# Altium project Relay_SW.PrjPcb
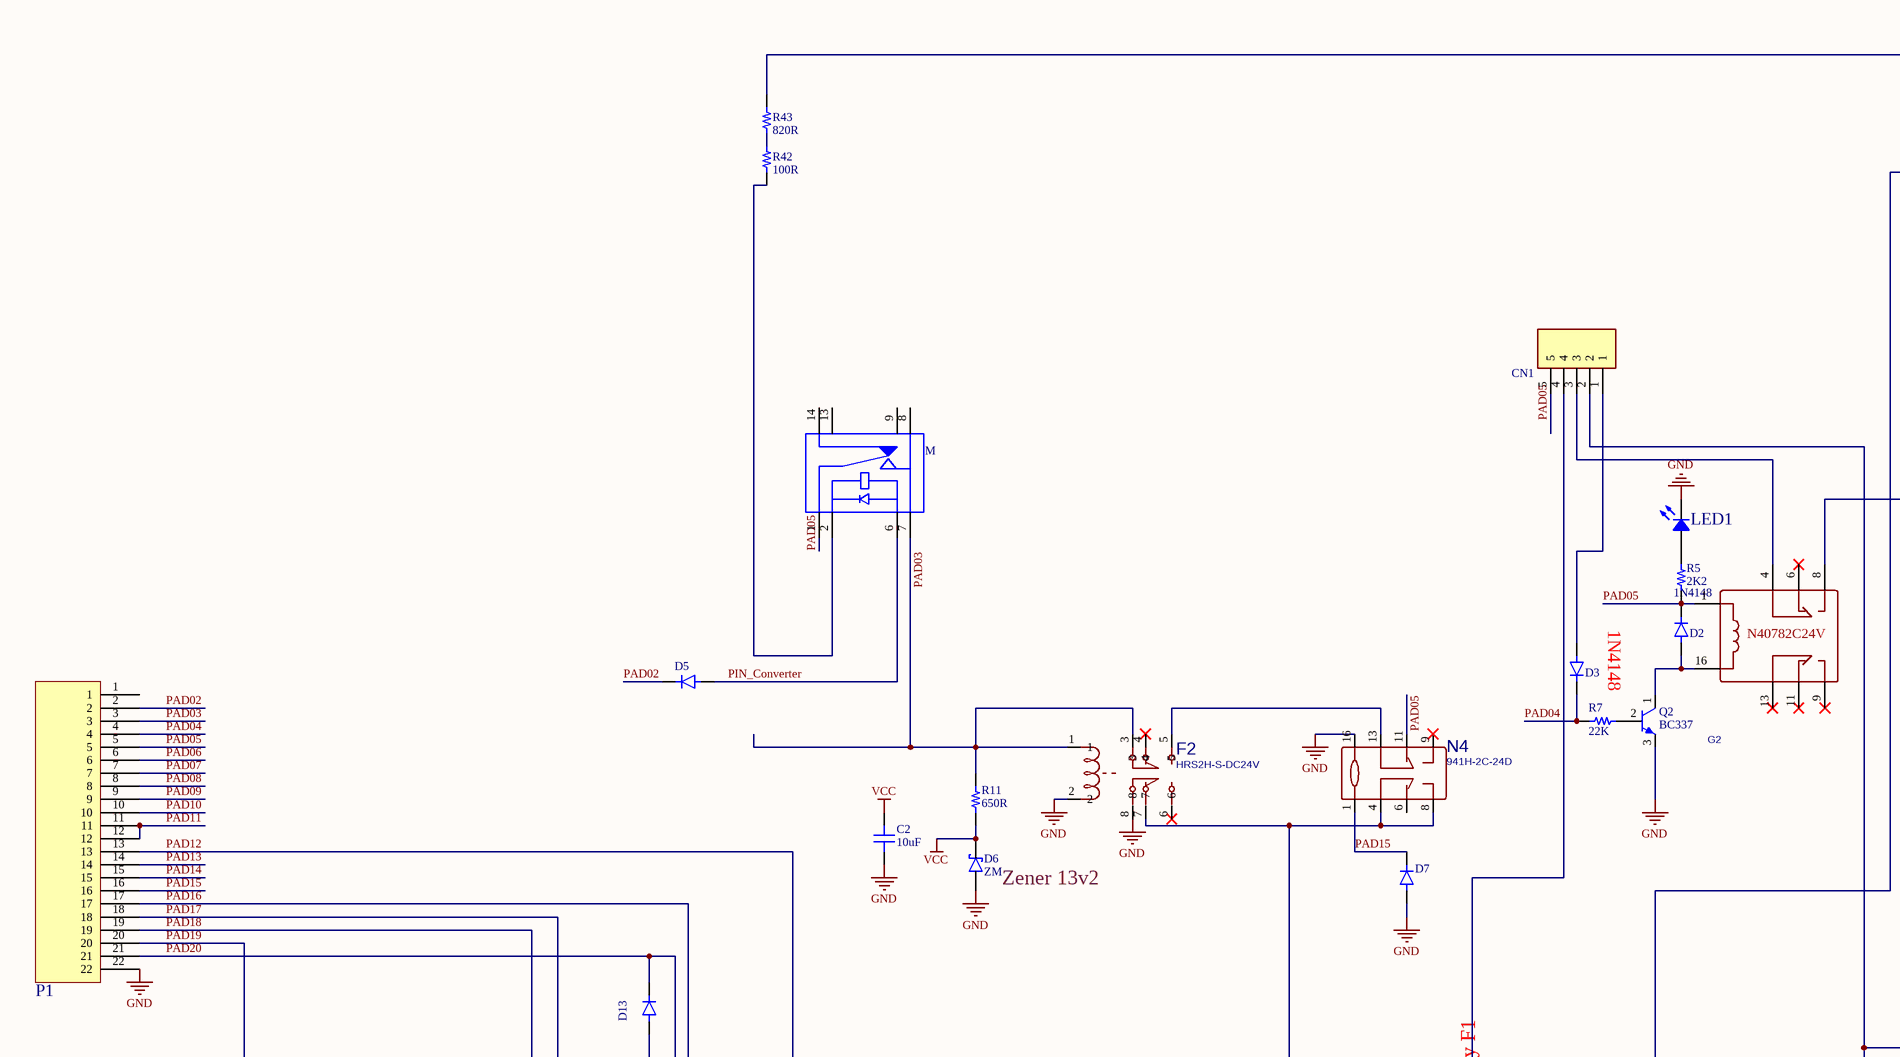
[diagram p0: Sheet1.SchDoc, top left]
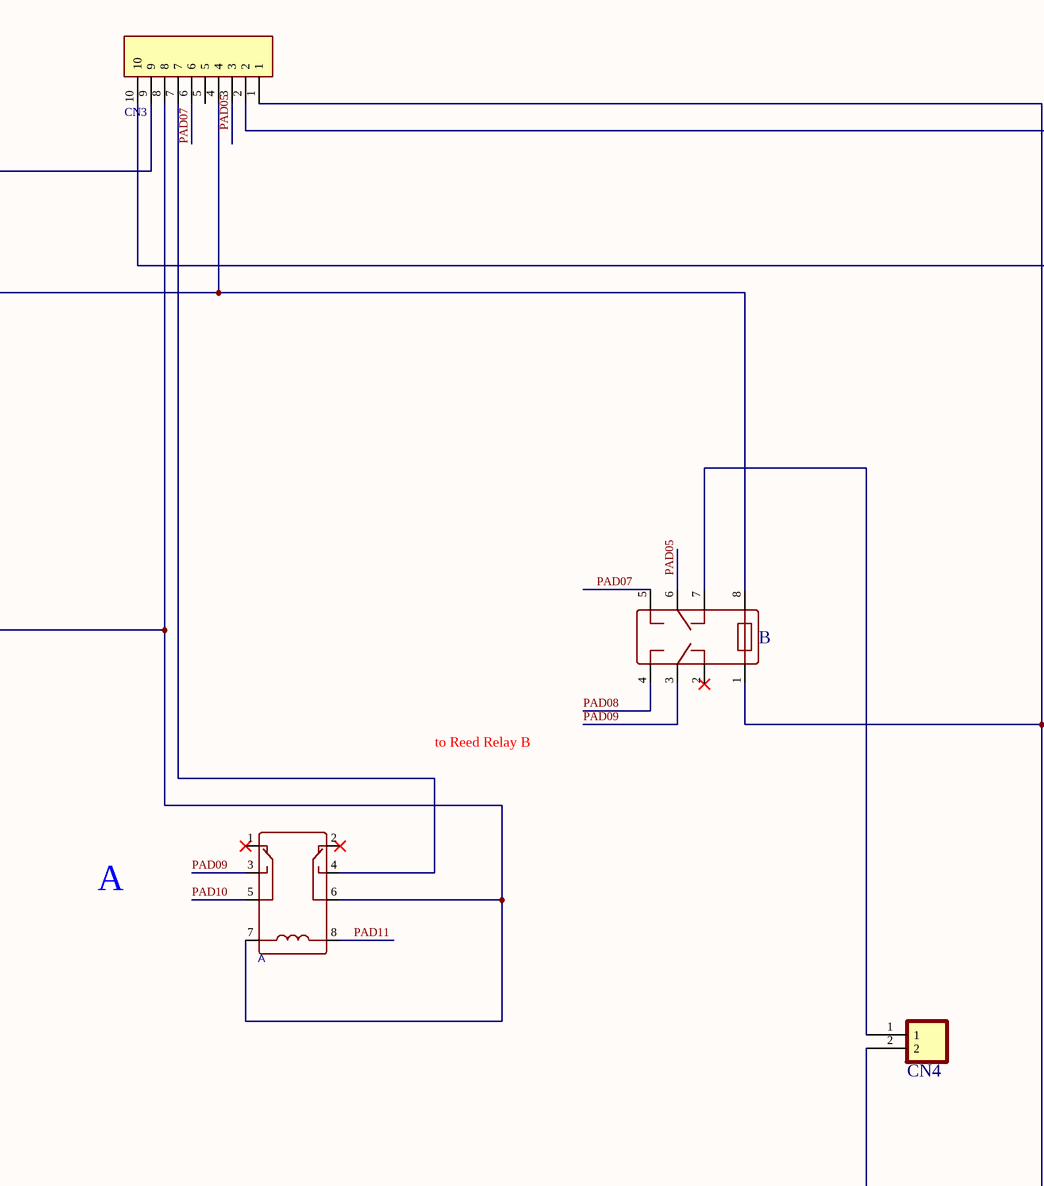
[diagram p1: Sheet1.SchDoc, top right]
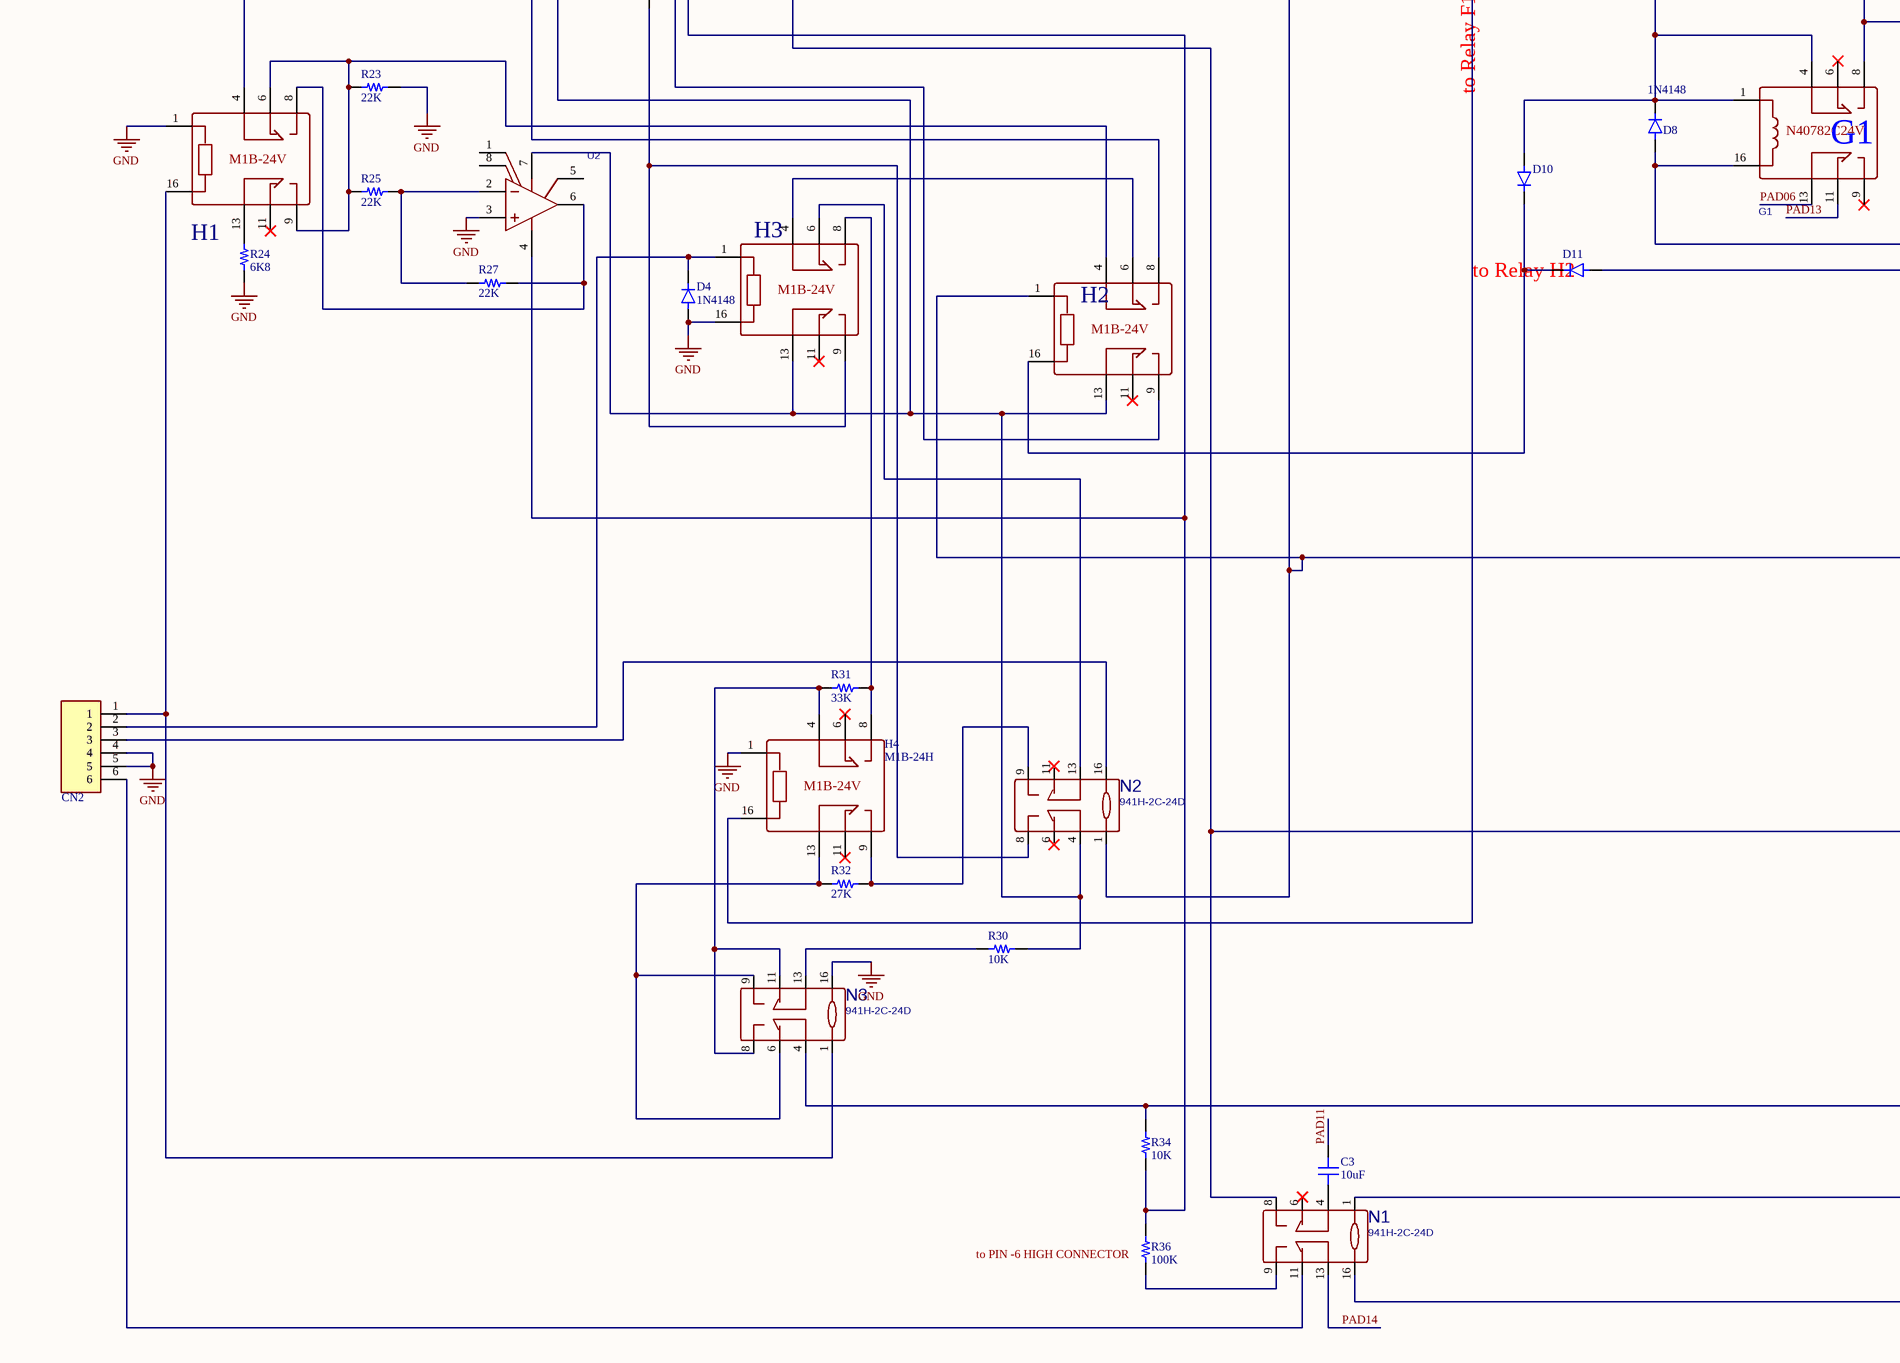
[diagram p2: Sheet1.SchDoc, bottom left]
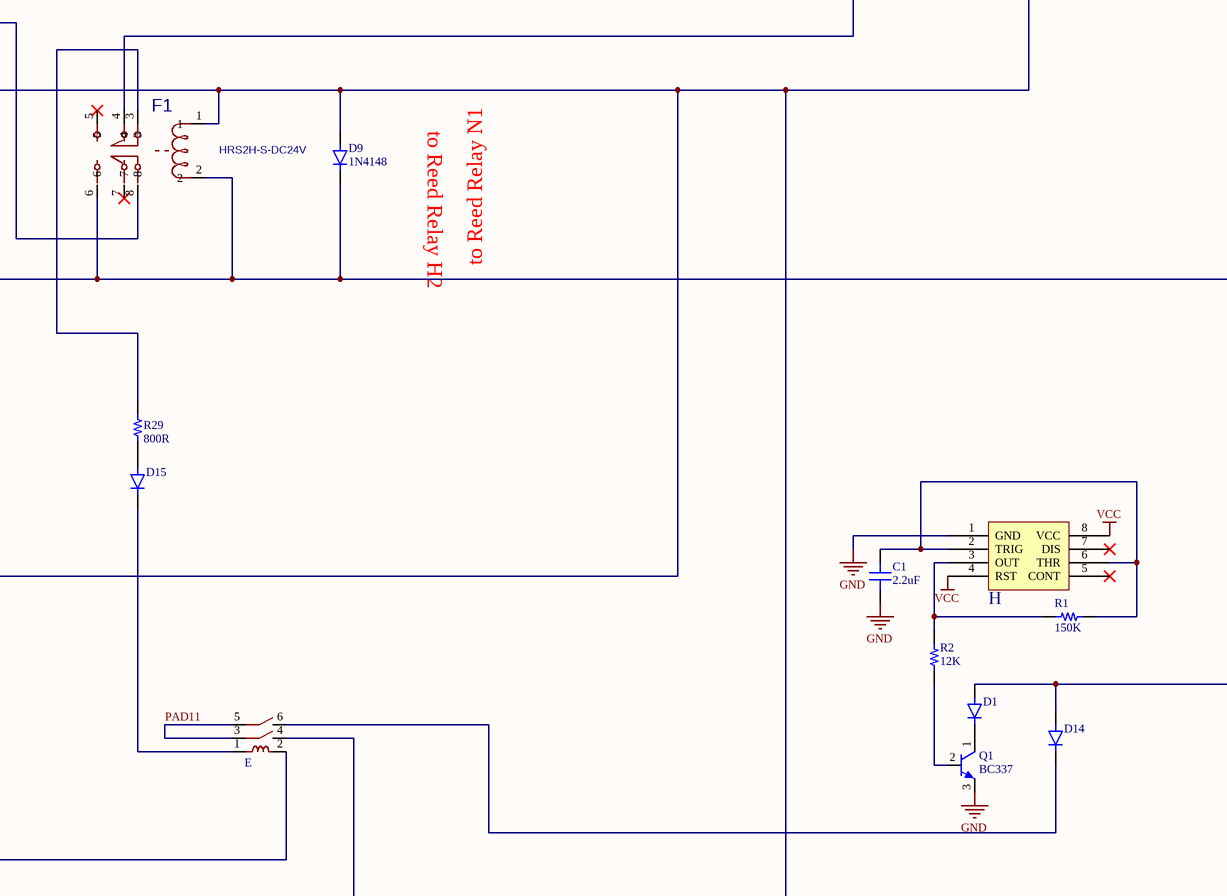
[diagram p3: Sheet1.SchDoc, bottom right]
1 sheet, 60 parts. Net scope: global (net labels, ports and power ports of the same name join across sheets).
Board file: Relay_SW.PcbDoc

## Sheet Sheet1.SchDoc
size D

### Parts
A  OMRON_LY2  [OMRON_LY2]  (value not drawn)
B  942H-2C-24DC  [942H-2C-24DC]  (value not drawn)
C1  2.2uF  [Cap0805]
C2  10uF  [Cap0805]
C3  10uF  [Cap0805]
CN1  HDR5  [HDR5_F]  (value not drawn)
CN2  HDR6  [HDR6_F]  (value not drawn)
CN3  HDR10  [HDR10_F]  (value not drawn)
CN4  PWR_HDR_2P  [PWR_HDR_2P]  (value not drawn)
D1  (no value)  [SOD-123]
D2  1N4148  [SOD-123]
D3  (no value)  [SOD-123]
D4  1N4148  [SOD-123]
D5  (no value)  [SOD-123]
D6  ZM  [Melf]
D7  (no value)  [SOD-123]
D8  1N4148  [SOD-123]
D9  1N4148  [SOD-123]
D10  (no value)  [SOD-123]
D11  (no value)  [SOD-123]
D13  (no value)  [SOD-123]
D14  (no value)  [SOD-123]
D15  (no value)  [SOD-123]
E  OL-C-212H  [ol-c-212H]  (value not drawn)
F1  HRS2H-S-DC24V  [HRS2H-S-DC24V]
F2  HRS2H-S-DC24V  [HRS2H-S-DC24V]
G1  N40782C12V0.2W  [N40782CXXXXX]  (value not drawn)
G2  N40782C12V0.2W  [N40782CXXXXX]  (value not drawn)
H  NE555P  [SOP8]  (value not drawn)
H1  M1B-24H  [M1B-24H]  (value not drawn)
H2  M1B-24H  [M1B-24H]  (value not drawn)
H3  M1B-24H  [M1B-24H]  (value not drawn)
H4  M1B-24H  [M1B-24H]
LED1  ---  [0805 LED]  (value not drawn)
M  HE721R0510  [HE721R0510]  (value not drawn)
N1  941H-2C-24D  [941H-2C-24D]
N2  941H-2C-24D  [941H-2C-24D]
N3  941H-2C-24D  [941H-2C-24D]
N4  941H-2C-24D  [941H-2C-24D]
P1  PCI  [PCI]  (value not drawn)
Q1  BC337  [TO92]
Q2  BC337  [TO92]
R1  150K  [Res1206]
R2  12K  [Res1206]
R5  2K2  [Res1206]
R7  22K  [Res1206]
R11  650R  [Res1206]
R23  22K  [Res1206]
R24  6K8  [Res1206]
R25  22K  [Res1206]
R27  22K  [Res1206]
R29  800R  [Res1206]
R30  10K  [Res1206]
R31  33K  [Res1206]
R32  27K  [Res1206]
R34  10K  [Res1206]
R36  100K  [Res1206]
R42  100R  [Res1206]
R43  820R  [Res1206]
U2  OP07CP  [SOP8]  (value not drawn)

### Nets
GND: C1.1 C2.1 CN2.4 CN2.5 D4.A D6.A D7.A F2.2 F2.8 H.1(GND) H1.1 H3.16 H4.1 LED1.2 N3.16 N4.16 P1.22 Q1.3(E) Q2.3(E) R23.2 R24.2 U2.3
VCC: C2.2 D6.C H.4(RST) H.8(VCC) R11.1
PAD02: D5.C P1.2
PAD03: F2.1 F2.3 M.7 P1.3 R11.2
PAD04: D3.C P1.4 R7.1
PAD05: B.6 CN1.5 CN3.3 D2.C G2.1 M.1 N4.11 P1.5 R5.1
PAD06: G1.13 P1.6
PAD07: B.5 CN3.6 P1.7
PAD08: B.4 P1.8
PAD09: A.3 B.3 P1.9
PAD10: A.5 P1.10
PAD11: A.8 C3.2 E.3 E.5 P1.11 P1.12
PAD12: E.2 N1.8 P1.13
PAD13: G1.11 P1.14
PAD14: N1.13 P1.15
PAD15: D7.C N4.1 P1.16
PAD16: P1.17 R34.2 R36.1 U2.4
PAD17: H2.13 H3.13 N2.4 P1.18 R30.2 U2.7
PAD18: H2.8 P1.19
PAD19: H1.4 P1.20
PAD20: D13.C H2.9 P1.21
PIN_Converter: D5.A M.6
NetA_4: A.4 CN3.7
NetA_6: A.6 A.7 CN3.8 G2.8
NetB_1: B.1 CN3.1 D8.A D9.A F1.1 F2.7 G1.16 H2.1 N1.16 N2.1 N4.4 N4.8
NetB_7: B.7 CN4.1
NetB_8: B.8 CN3.4 D8.C D10.A G1.1 G1.4
NetC1_2: C1.2 H.2(TRIG) H.6(THR) R1.1
NetC3_1: C3.1 N1.4
NetCN1_1: CN1.1 D3.A
NetCN1_2: CN1.2 F1.8 G1.8
NetCN1_3: CN1.3 G2.4
NetCN1_4: CN1.4 H4.16
NetCN2_1: CN2.1 H1.16 N3.1
NetCN2_2: CN2.2 D4.C H3.1
NetCN2_3: CN2.3 N2.16
NetCN2_6: CN2.6 N1.11
NetCN3_2: CN3.2 D1.A D14.A
NetCN3_9: CN3.9 R43.2
NetCN3_10: CN3.10 D9.C D11.A F1.2 F1.6 N1.1
NetCN4_2: CN4.2 F1.4
NetD1_C: D1.C Q1.1(C)
NetD2_A: D2.A G2.16 Q2.1(C)
NetD10_C: D10.C D11.C H2.16
NetD13_A: D13.A H3.9 N2.8
NetD14_C: D14.C E.6
NetD15_A: D15.A R29.2
NetD15_C: D15.C E.1
NetE_4: E.4 N3.4 R34.1
NetF1_3: F1.3 R29.1
NetF2_5: F2.5 N4.13
NetH1_6: H1.6 H1.9 H2.4 R23.1 R25.1
NetH1_8: H1.8 R27.1 U2.6
NetH1_13: H1.13 R24.1
NetH2_6: H2.6 H3.4
NetH3_6: H3.6 N2.13
NetH3_8: H3.8 H4.8 R31.1
NetH4_4: H4.4 N3.8 N3.11 R31.2
NetH4_9: H4.9 N2.9 R32.2
NetH4_13: H4.13 N3.6 N3.9 R32.1
NetH_3: H.3(OUT) R1.2 R2.2
NetLED1_1: LED1.1 R5.2
NetM_2: M.2 R42.1
NetN1_9: N1.9 R36.2
NetN3_13: N3.13 R30.1
NetQ1_2: Q1.2(B) R2.1
NetQ2_2: Q2.2(B) R7.2
NetR25_2: R25.2 R27.2 U2.2
NetR42_2: R42.2 R43.1

Not connected (* = marked no-connect by the designer): A 1* 2*; B 2*; CN3 5; F1 5* 7*; F2 4* 6*; G1 6* 9*; G2 6* 9* 11* 13*; H 5(CONT)* 7(DIS)*; H1 11*; H2 11*; H3 11*; H4 6* 11*; M 8 9 13 14; N1 6*; N2 6* 11*; N4 6 9*; P1 1; U2 1 5 8

### Notes on the sheet
- 1N4148
- to Reed Relay B
- A
- (near D6) Zener 13v2
- to Relay F1
- (near G1) G1
- to Reed Relay H2
- (near D11) to Relay H2
- to Reed Relay N1
- (near R36) to PIN -6 HIGH CONNECTOR
- (in symbol M1B-24H) M1B-24V
- (in symbol N40782C24V0.2W) N40782C24V

### Library data of the parts
A = OMRON_LY2: Manufacturer: NF(福特); Manufacturer Part: N40782C12V0.2W; Contributor: lcsc; ID: 114; Supplier: LCSC; Supplier Part: C7473079; spicePre: U; spiceSymbolName: N40782C12V0.2W; Part Number: OMRON_LY2
B = 942H-2C-24DC: Relay 2C 24VDC; ID: 112; Additionner: S.Pourmohammad; Part Number: 942H-2C-24DC; Category: Relay
C1 = Cap-0805-2.2uF: Cap 0805 2.2uF; Manufacturer: ---; ID: 35; Additionner: A.Abdolahzadeh; Part Number: Cap-0805-2.2uF; Category: Cap; Sub-Category: Cer0805; Adding Time: 1401-05-15; Datasheet Path: ---; Supplier: Ic Kala
C2 C3 = Cap-0805-10uF: Cap 0805 10uF; Manufacturer: ---; ID: 49; Additionner: S.Pourmohammad; Part Number: Cap-0805-10uF; Category: Cap; Sub-Category: Cer0805; Adding Time: 1401-05-17; Datasheet Path: ---; Supplier: Ic Kala
CN1 = PinHeader 5pin: Pitch 2.54 mm 5PIN Femail; Manufacturer: ---; MP: HTSW-105-14-L-S; ID: 78; Additionner: S.Pourmohammad; Value: *; Package: None; Price: None; Availability: Unavailable; Part Number: PinHeader 5pin; Category: Connector; Sub-Category: Header; Adding Time: 1402-10-1; Datasheet Path: ---
CN2 = PinHeader 6pin: Pitch 2.54 mm; Manufacturer: ---; MP: HTSW-106-07-S-S; ID: 79; Additionner: S.Pourmohammad; Availability: Unavailable; Value: *; Price: None; Package: None; Part Number: PinHeader 6pin; Category: Connector; Sub-Category: Header; Adding Time: 1402-10-1; Datasheet Path: ---
CN3 = PinHeader 10pin: Pitch 2.54 mm; Manufacturer: ---; MP: HTSW-106-07-S-S; ID: 80; Additionner: S.Pourmohammad; Availability: Unavailable; Value: *; Price: None; Package: None; Part Number: PinHeader 10pin; Category: Connector; Sub-Category: Header; Adding Time: 1402-10-1; Datasheet Path: ---
CN4 = Power Connector: P-P= 3.96mm; ID: 83; Additionner: S.Pourmohammad; Part Number: Power Connector; Category: Connector; Sub-Category: Power Connector; Adding Time: 1402-10-1
D1 D7 D10 D11 D14 D15 = 1N4148: Diode Standard 75 V 300mA (DC) Through Hole DO-35 Mimi Melf; MP: 1N4148; MF: ON Semiconductor; ID: 113; Additionner: S.Pourmohammad; Price: None; Availability: In Stock; Package: AXIAL LEAD-2 ON Semiconductor; Value: *; SnapEDA_Link: https://www.snapeda.com/parts/1N4148/Onsemi/view-part/?ref=snap; Purchase-URL: https://pricing.snapeda.com/search/part/1N4148/?ref=eda; Check_prices: https://www.snapeda.com/parts/1N4148/Onsemi/view-part/?ref=eda; Part Number: 1N4148; Category: Diode; Sub-Category: standard; Adding Time: 1402-10-1
D2 D4 D8 D9 = 1N4148: Diode Standard 75 V 300mA (DC) Through Hole DO-35 Mimi Melf; MF: ON Semiconductor; ID: 113; Additionner: S.Pourmohammad; Value: *; Price: None; Package: AXIAL LEAD-2 ON Semiconductor; Check_prices: https://www.snapeda.com/parts/1N4148/Onsemi/view-part/?ref=eda; Availability: In Stock; SnapEDA_Link: https://www.snapeda.com/parts/1N4148/Onsemi/view-part/?ref=snap; MP: 1N4148; Purchase-URL: https://pricing.snapeda.com/search/part/1N4148/?ref=eda; Part Number: 1N4148; Category: Diode; Sub-Category: standard; Adding Time: 1402-10-1
D3 D5 D13 = 1N4148: Diode Standard 75 V 300mA (DC) Through Hole DO-35 Mimi Melf; MF: ON Semiconductor; MP: 1N4148; ID: 113; Additionner: S.Pourmohammad; Value: *; Price: None; Package: AXIAL LEAD-2 ON Semiconductor; Check_prices: https://www.snapeda.com/parts/1N4148/Onsemi/view-part/?ref=eda; Availability: In Stock; SnapEDA_Link: https://www.snapeda.com/parts/1N4148/Onsemi/view-part/?ref=snap; Purchase-URL: https://pricing.snapeda.com/search/part/1N4148/?ref=eda; Part Number: 1N4148; Category: Diode; Sub-Category: standard; Adding Time: 1402-10-1
D6 = ZM: Zener Diode Melf; MP: TMMBAT41; MF: STMicroelectronics; ID: 132; Additionner: S.Pourmohammad; SnapEDA_Link: https://www.snapeda.com/parts/TMMBAT41/STMicroelectronics/view-part/2894620/?ref=snap; Value: *; Availability: Not in stock; Check_prices: https://www.snapeda.com/parts/TMMBAT41/STMicroelectronics/view-part/2894620/?ref=eda; Package: DO-213 STMicroelectronics; Price: None; Part Number: ZM; Category: Diode; Sub-Category: Zener
E = OL-C-212H: REED RELAY  2 Contact; ID: 130; Additionner: S.Pourmohammad; Part Number: OL-C-212H; Category: Relay; Sub-Category: RELAY REED SPDT; Adding Time: 1402-10-1; Supplier: ……..
F1 F2 = HRS2H-S-DC24V: Manufacturer: HKE(汇港); Supplier: LCSC; Manufacturer Part: HRS2H-S-DC24V; Supplier Part: C12249; JLCPCB Part Class: Extended Part; spicePre: K; spiceSymbolName: HRS2H-S-DC24V
G1 G2 = N40782C24V0.2W: Manufacturer: NF(福特); Contributor: lcsc; Supplier: LCSC; Supplier Part: C7473079; Manufacturer Part: N40782C12V0.2W; spicePre: U; spiceSymbolName: N40782C12V0.2W
H = NE555P: Astable or Monostable Operation; Manufacturer: TI; ID: 115; Additionner: S.Pourmohammad; Part Number: NE555P; Category: IC; Sub-Category: Timer; Adding Time: 1402-10-1
LED1 = 598-8110-107F: LED 0805 Red 635nm, Forward Current: 20mA, Forward Voltage: 1.7V; Manufacturer: Dialight; Additionner: M.Moghimi; ID: 22; Part Number: 598-8110-107F; Adding Time: 1400-09-14; Category: LED; Sub-Category: SMD-0805; Datasheet Path: Datasheets\LED-Dialight-598Series.PDF
M = HE721R0510: RELAY REED SPDT 250MA 5V; Manufacturer: Littelfuse_Inc; MF: Littelfuse Inc.; ID: 110; Additionner: S.Pourmohammad; Digi-Key_Part_Number: F11467-ND; MP: HE721R0510; Value: *; SnapEDA_Link: https://www.snapeda.com/parts/HE721R0510/Littelfuse%20Inc./view-part/1739461/?ref=snap; Package: None; Digi-Key_Purchase_URL: https://www.digikey.com/product-detail/en/littelfuse-inc/HE721R0510/F11467-ND/4780712?utm_source=snapeda&utm_medium=aggregator&utm_campaign=symbol; Part Number: HE721R0510; Category: Relay; Sub-Category: RELAY REED SPDT; Adding Time: 1402-10-1; Datasheet Path: D:\Project\metal\datasheet\HE721R0510_Littelfuse_Inc..pdf; Supplier: skytech
N1-N4 = 941H-2C-24D: Manufacturer: 欣大; Contributor: LCSC; Supplier: LCSC; Supplier Part: C259271; Manufacturer Part: 941H-2C-24D; JLCPCB Part Class: Extended Part; spicePre: K; spiceSymbolName: 941H-2C-24D
P1 = PCI: normal PAD for SPARK project; ID: 81; Additionner: S.Pourmohammad; Part Number: PCI; Category: Connector; Sub-Category: PCI; Adding Time: 1402-10-1
Q1 Q2 = BC337: Transistor; Manufacturer: Diodes-Incorporated; ID: 118; Additionner: S.Pourmohammad; Part Number: BC337; Category: Transistor; Sub-Category: BJT-NPN; Adding Time: 1402-10-1; Supplier: Ic Kala
R1 = Res-1206-150K: Resistor 1206 150 Kohm; Value: 1K; ID: 72; Additionner: S.Pourmohammad; Part Number: Res-1206-150K; Category: Res; Sub-Category: SMD-1206; Adding Time: 1402-10-1; Supplier: Ic Kala
R2 = Res-1206-12K: Resistor 1206 12 Kohm; Value: 1K; ID: 68; Additionner: S.Pourmohammad; Part Number: Res-1206-12K; Category: Res; Sub-Category: SMD-1206; Adding Time: 1402-10-1; Supplier: Ic Kala
R5 = Res-1206-2K2: Resistor 1206 2.2 Kohm; Value: 1K; ID: 82; Additionner: S.Pourmohammad; Part Number: Res-1206-2K2; Category: Res; Sub-Category: SMD-1206; Adding Time: 1402-10-1; Supplier: Ic Kala
R7 R23 R25 R27 = Res-1206-22K: Resistor 1206 22 Kohm; Value: 1K; ID: 69; Additionner: S.Pourmohammad; Part Number: Res-1206-22K; Category: Res; Sub-Category: SMD-1206; Adding Time: 1402-10-1; Supplier: Ic Kala
R11 = Res-1206-650R: Resistor 1206 650 ohm; Value: 1K; ID: 73; Additionner: S.Pourmohammad; Part Number: Res-1206-650R; Category: Res; Sub-Category: SMD-1206; Adding Time: 1402-10-1; Supplier: Ic Kala
R24 = Res-1206-6K8: Resistor 1206 6.8 Kohm; Value: 1K; ID: 67; Additionner: S.Pourmohammad; Part Number: Res-1206-6K8; Category: Res; Sub-Category: SMD-1206; Adding Time: 1402-10-1; Supplier: Ic Kala
R29 = Res-1206-800R: Resistor 1206 800 ohm; Value: 1K; ID: 76; Additionner: S.Pourmohammad; Part Number: Res-1206-800R; Category: Res; Sub-Category: SMD-1206; Adding Time: 1402-10-1; Supplier: Ic Kala
R30 R34 = Res-1206-10K: Resistor 1206 10 Kohm; Manufacturer: ---; Value: 1K; ID: 66; Additionner: S.Pourmohammad; Part Number: Res-1206-10K; Category: Res; Sub-Category: SMD-1206; Adding Time: 1402-10-1; Datasheet Path: ---; Supplier: Ic Kala
R31 = Res-1206-33K: Resistor 1206 33 Kohm; Value: 1K; ID: 71; Additionner: S.Pourmohammad; Part Number: Res-1206-33K; Category: Res; Sub-Category: SMD-1206; Adding Time: 1402-10-1; Supplier: Ic Kala
R32 = Res-1206-27K: Resistor 1206 27 Kohm; Value: 1K; ID: 70; Additionner: S.Pourmohammad; Part Number: Res-1206-27K; Category: Res; Sub-Category: SMD-1206; Adding Time: 1402-10-1; Supplier: Ic Kala
R36 = Res-1206-100K: Manufacturer: ---; Value: 1K; ID: 96; Additionner: A.Abdolahzadeh; Part Number: Res-1206-100K; Category: Res; Sub-Category: SMD-1206; Adding Time: 1402-09-24; Datasheet Path: ---
R42 = Res-1206-100R: Resistor 1206 100 ohm; Value: 1K; ID: 75; Additionner: S.Pourmohammad; Part Number: Res-1206-100R; Category: Res; Sub-Category: SMD-1206; Adding Time: 1402-10-1; Supplier: Ic Kala
R43 = Res-1206-820R: Resistor 1206 820 ohm; Value: 1K; ID: 77; Additionner: S.Pourmohammad; Part Number: Res-1206-820R; Category: Res; Sub-Category: SMD-1206; Adding Time: 1402-10-1; Supplier: Ic Kala
U2 = OP07CP: OPAMP; Manufacturer: TI; ID: 116; Additionner: S.Pourmohammad; spicePre: X; Supplier: LCSC; Manufacturer Part: OP07CP; Supplier Part: C5224; JLCPCB Part Class: Extended Part; spiceSymbolName: OP07CP; Part Number: OP07CP; Category: IC; Sub-Category: OPAMP; Adding Time: 1402-10-1